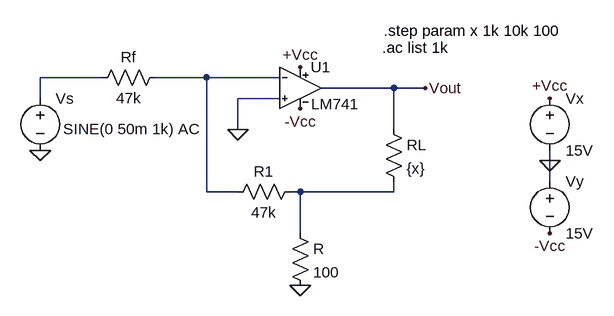
[diagram p0: schematic CCCS.asc]
CCCS.asc, the LTspice schematic file:
Version 4
SHEET 1 904 680
WIRE -112 144 -208 144
WIRE 48 144 -32 144
WIRE 160 144 48 144
WIRE 336 160 224 160
WIRE 384 160 336 160
WIRE -208 176 -208 144
WIRE 160 176 96 176
WIRE 96 224 96 176
WIRE 336 224 336 160
WIRE 576 272 576 256
WIRE 576 304 576 272
WIRE 48 320 48 144
WIRE 96 320 48 320
WIRE 192 320 176 320
WIRE 336 320 336 304
WIRE 336 320 192 320
WIRE 192 384 192 320
FLAG 192 128 +Vcc
FLAG 192 192 -Vcc
FLAG -208 256 0
FLAG 96 224 0
FLAG 192 464 0
FLAG 384 160 Vout
FLAG 576 272 0
FLAG 576 176 +Vcc
FLAG 576 384 -Vcc
SYMBOL LM741 192 96 R0
SYMATTR InstName U1
SYMBOL voltage -208 160 R0
WINDOW 3 35 63 Left 2
WINDOW 123 24 124 Left 2
WINDOW 39 0 0 Left 2
SYMATTR Value SINE(0 50m 1k) AC
SYMATTR InstName Vs
SYMBOL res -16 128 R90
WINDOW 0 0 56 VBottom 2
WINDOW 3 32 56 VTop 2
SYMATTR InstName Rf
SYMATTR Value 47k
SYMBOL res 320 208 R0
SYMATTR InstName RL
SYMATTR Value {x}
SYMBOL res 176 368 R0
SYMATTR InstName R
SYMATTR Value 100
SYMBOL res 192 304 R90
WINDOW 0 0 56 VBottom 2
WINDOW 3 32 56 VTop 2
SYMATTR InstName R1
SYMATTR Value 47k
SYMBOL voltage 576 160 R0
SYMATTR InstName Vx
SYMATTR Value 15V
SYMBOL voltage 576 288 R0
SYMATTR InstName Vy
SYMATTR Value 15V
TEXT 318 98 Left 2 !.ac list 1k
TEXT 320 72 Left 2 !.step param x 1k 10k 100

The netlist it stands for:
* CCCS.asc
XU1 0 N002 +Vcc -Vcc Vout LM741  ; pins In+ In- V+ V- OUT
Vs N001 0 SINE(0 50m 1k) AC
Rf N002 N001 47k
RL Vout N003 {x}
R N003 0 100
R1 N003 N002 47k
Vx +Vcc 0 15V
Vy 0 -Vcc 15V
.ac list 1k
.step param x 1k 10k 100
.lib LM741.lib
.backanno
.end